# Altium schematic sheet IMU.SchDoc: Inertial Measurement Unit
size A4; Date: 2022 Fall; Address1: LK Bulls; Address2: Bagoly Zoltan; Address3: Feher Daniel; Address4: G. Varga Gabor; DocumentNumber: 14; Revision: 1.0; SheetNumber: 14; SheetTotal: 14
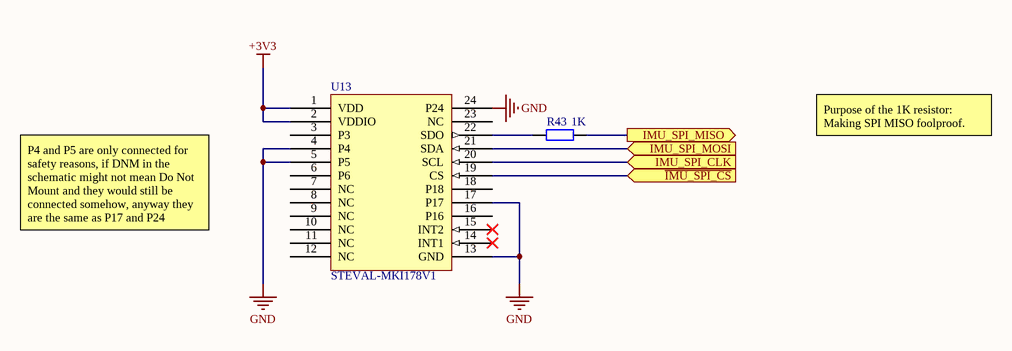
[diagram p0: IMU.SchDoc]

## Parts
R43  1K  [FP_0805_RES]
U13  STEVAL-MKI178V1  [FP_STEVAL_IMU]

## Ports
IMU_SPI_CLK (in), IMU_SPI_MISO (out), IMU_SPI_MOSI (in), ~{IMU_SPI_CS} (in)

## Nets
+3V3: U13.1(VDD) U13.2(VDDIO)
GND: U13.4(P4) U13.5(P5) U13.13(GND) U13.17(P17) U13.24(P24)
~{IMU_SPI_CS}: U13.19(CS) ; port ~{IMU_SPI_CS}
IMU_SPI_CLK: U13.20(SCL) ; port IMU_SPI_CLK
IMU_SPI_MISO: R43.2 ; port IMU_SPI_MISO
IMU_SPI_MOSI: U13.21(SDA) ; port IMU_SPI_MOSI
NetR43_1: R43.1 U13.22(SDO)

Not connected (* = marked no-connect by the designer): U13 3(P3) 6(P6) 7(NC) 8(NC) 9(NC) 10(NC) 11(NC) 12(NC) 14(INT1)* 15(INT2)* 16(P16) 18(P18) 23(NC)

## Notes on the sheet
- Purpose of the 1K resistor: Making SPI MISO foolproof.
- P4 and P5 are only connected for safety reasons, if DNM in the schematic might not mean Do Not Mount and they would still be connected somehow, anyway they are the same as P17 and P24
- Title
- Size:
- Date:
- A4
- Number:
- Revision:
- Sheet
- of
- Designed by:
- File:

## Library data of the parts
R43 = RES: Resistor; Tolerance: 5%; Power: 0.125W; Name: 1K00 0805 5% CR-05JL7----1K 0.125W (VIK); Supplier: Lomex; Reference: 81-10-87; Value: 1K
U13 = STEVAL-MKI178V1: Adapter board for LSM6DS3H 3D digital accelerometer and 3D digital gyroscope , SPI/I2C interface; Name: HÜVELY 40 P FHSH-2.54-40 (T-T) 1# h=8,5mm AU; Supplier: Lomex; Reference: 43-03-71